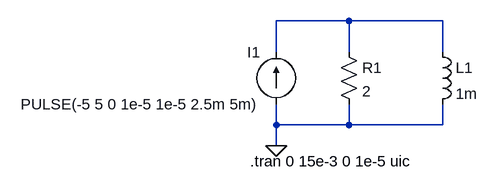
[diagram p0: schematic tran_network5.asc]
tran_network5.asc, the LTspice schematic file:
Version 4
SHEET 1 880 680
WIRE 224 80 112 80
WIRE 368 80 224 80
WIRE 112 128 112 80
WIRE 224 128 224 80
WIRE 368 128 368 80
WIRE 112 240 112 208
WIRE 224 240 224 208
WIRE 224 240 112 240
WIRE 368 240 368 208
WIRE 368 240 224 240
WIRE 112 272 112 240
FLAG 112 272 0
SYMBOL current 112 208 R180
WINDOW 0 24 80 Left 2
WINDOW 3 24 0 Left 2
WINDOW 123 0 0 Left 2
WINDOW 39 0 0 Left 2
SYMATTR InstName I1
SYMATTR Value PULSE(-5 5 0 1e-5 1e-5 2.5m 5m)
SYMBOL res 208 112 R0
SYMATTR InstName R1
SYMATTR Value 2
SYMBOL ind 352 112 R0
SYMATTR InstName L1
SYMATTR Value 1m
SYMATTR SpiceLine Rser=0
TEXT 72 296 Left 2 !.tran 0 15e-3 0 1e-5 uic

The netlist it stands for:
* tran_network5.asc
I1 0 N001 PULSE(-5 5 0 1e-5 1e-5 2.5m 5m)
R1 N001 0 2
L1 N001 0 1m Rser=0
.tran 0 15e-3 0 1e-5 uic
.backanno
.end